# Altium schematic sheet Main.SchDoc
size A; SheetNumber: 1; SheetTotal: 3
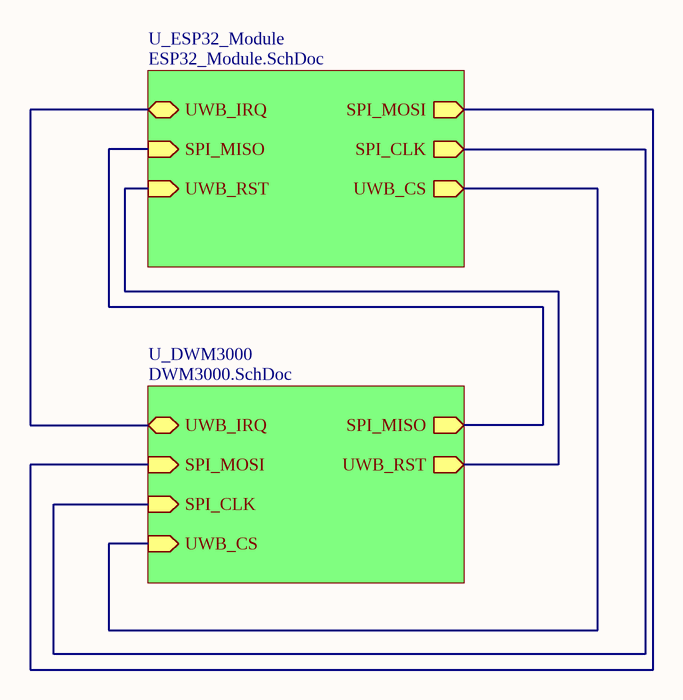
[diagram p0: Main.SchDoc]

## Sub-sheets
U_DWM3000 = DWM3000.SchDoc: UWB_IRQ (bidir), SPI_MOSI (in), SPI_MISO (out), SPI_CLK (in), UWB_CS (in), UWB_RST (out)
U_ESP32_Module = ESP32_Module.SchDoc: UWB_IRQ (bidir), SPI_MOSI (out), SPI_MISO (in), SPI_CLK (out), UWB_CS (out), UWB_RST (in)

## Nets
(unnamed): sheet U_ESP32_Module/UWB_IRQ, sheet U_DWM3000/UWB_IRQ
(unnamed): sheet U_ESP32_Module/SPI_MOSI, sheet U_DWM3000/SPI_MOSI
(unnamed): sheet U_ESP32_Module/SPI_MISO, sheet U_DWM3000/SPI_MISO
(unnamed): sheet U_ESP32_Module/SPI_CLK, sheet U_DWM3000/SPI_CLK
(unnamed): sheet U_ESP32_Module/UWB_CS, sheet U_DWM3000/UWB_CS
(unnamed): sheet U_ESP32_Module/UWB_RST, sheet U_DWM3000/UWB_RST